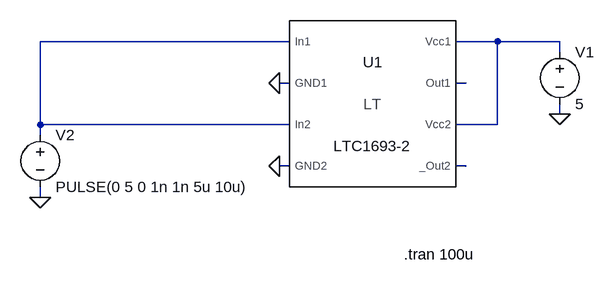
[diagram p0: schematic 1693-2.asc]
1693-2.asc, the LTspice schematic file:
Version 4
SHEET 1 2388 1428
WIRE 1440 1072 1056 1072
WIRE 1760 1072 1696 1072
WIRE 1856 1072 1760 1072
WIRE 1856 1088 1856 1072
WIRE 1440 1136 1424 1136
WIRE 1712 1136 1696 1136
WIRE 1856 1184 1856 1168
WIRE 1056 1200 1056 1072
WIRE 1440 1200 1056 1200
WIRE 1760 1200 1760 1072
WIRE 1760 1200 1696 1200
WIRE 1056 1216 1056 1200
WIRE 1440 1264 1424 1264
WIRE 1712 1264 1696 1264
WIRE 1056 1312 1056 1296
FLAG 1856 1184 0
FLAG 1424 1264 0
FLAG 1424 1136 0
FLAG 1056 1312 0
SYMBOL voltage 1856 1072 R0
SYMATTR InstName V1
SYMATTR Value 5
SYMBOL PowerProducts\\LTC1693-2 1568 1168 R0
SYMATTR InstName U1
SYMBOL voltage 1056 1200 R0
WINDOW 123 0 0 Left 2
WINDOW 39 0 0 Left 2
SYMATTR InstName V2
SYMATTR Value PULSE(0 5 0 1n 1n 5u 10u)
TEXT 1616 1400 Left 2 !.tran 100u

The netlist it stands for:
* 1693-2.asc
V1 N002 0 5
XU1 N001 0 N001 0 N004 N002 N003 N002 LTC1693-2  ; pins In1 GND1 In2 GND2 _Out2 Vcc2 Out1 Vcc1
V2 N001 0 PULSE(0 5 0 1n 1n 5u 10u)
.tran 100u
.lib LTC1693-2.sub
.backanno
.end